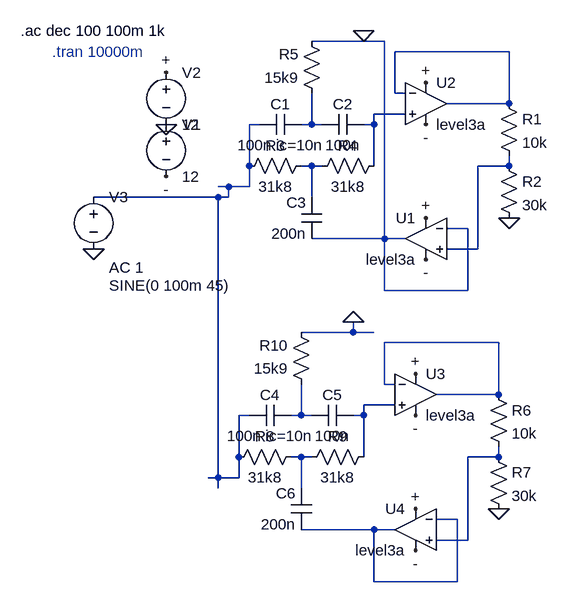
[diagram p0: schematic Filtro_NotchTwinT_DosTipos.asc]
Filtro_NotchTwinT_DosTipos.asc, the LTspice schematic file:
Version 4.1
SHEET 1 880 952
WIRE 80 112 -32 112
WIRE 272 128 96 128
WIRE 96 192 96 128
WIRE 112 192 96 192
WIRE 272 208 272 128
WIRE 272 208 176 208
WIRE 112 224 64 224
WIRE -112 240 -128 240
WIRE -32 240 -32 192
WIRE -32 240 -48 240
WIRE -16 240 -32 240
WIRE 64 240 64 224
WIRE 64 240 48 240
WIRE -128 304 -128 240
WIRE -32 304 -48 304
WIRE -16 304 -32 304
WIRE 64 304 64 240
WIRE 272 304 272 288
WIRE 272 304 224 304
WIRE -160 336 -176 336
WIRE -128 336 -128 304
WIRE -128 336 -160 336
WIRE -176 352 -368 352
WIRE -160 352 -160 336
WIRE -160 352 -176 352
WIRE -32 352 -32 304
WIRE 208 400 176 400
WIRE 80 416 80 112
WIRE 80 416 -32 416
WIRE 112 416 80 416
WIRE 224 432 224 304
WIRE 224 432 176 432
WIRE 80 496 80 416
WIRE 208 496 208 400
WIRE 208 496 80 496
WIRE 32 560 32 544
WIRE 32 560 -48 560
WIRE 64 560 32 560
WIRE 256 576 80 576
WIRE 80 640 80 576
WIRE 96 640 80 640
WIRE 256 656 256 576
WIRE 256 656 160 656
WIRE 96 672 48 672
WIRE -128 688 -144 688
WIRE -48 688 -48 640
WIRE -48 688 -64 688
WIRE -32 688 -48 688
WIRE 48 688 48 672
WIRE 48 688 32 688
WIRE -144 752 -144 688
WIRE -48 752 -64 752
WIRE -32 752 -48 752
WIRE 48 752 48 688
WIRE 256 752 256 736
WIRE 256 752 208 752
WIRE -176 784 -176 352
WIRE -176 784 -192 784
WIRE -144 784 -144 752
WIRE -144 784 -176 784
WIRE -176 800 -176 784
WIRE -48 800 -48 752
WIRE 192 848 160 848
WIRE 64 864 -48 864
WIRE 96 864 64 864
WIRE 208 880 208 752
WIRE 208 880 160 880
WIRE 64 944 64 864
WIRE 192 944 192 848
WIRE 192 944 64 944
FLAG -256 240 0
FLAG -256 160 +
FLAG 144 176 +
FLAG -256 320 -
FLAG 144 240 -
FLAG 144 384 +
FLAG 144 448 -
FLAG 272 384 0
FLAG 48 96 0
FLAG -368 432 0
FLAG 128 624 +
FLAG 128 688 -
FLAG 128 832 +
FLAG 128 896 -
FLAG 256 832 0
FLAG 32 544 0
SYMBOL OpAmps\\UniversalOpAmp3 144 208 R0
SYMATTR InstName U2
SYMBOL voltage -256 224 R0
WINDOW 123 0 0 Left 0
WINDOW 39 0 0 Left 0
SYMATTR InstName V1
SYMATTR Value 12
SYMBOL voltage -256 144 R0
WINDOW 123 0 0 Left 0
WINDOW 39 0 0 Left 0
SYMATTR InstName V2
SYMATTR Value 12
SYMBOL OpAmps\\UniversalOpAmp3 144 416 M0
SYMATTR InstName U1
SYMBOL res 256 192 R0
SYMATTR InstName R1
SYMATTR Value 10k
SYMBOL res 256 288 R0
SYMATTR InstName R2
SYMATTR Value 30k
SYMBOL cap -48 224 R90
WINDOW 0 0 32 VBottom 2
WINDOW 3 32 32 VTop 2
SYMATTR InstName C1
SYMATTR Value 100n ic=10n
SYMBOL cap 48 224 R90
WINDOW 0 0 32 VBottom 2
WINDOW 3 32 32 VTop 2
SYMATTR InstName C2
SYMATTR Value 100n
SYMBOL cap -16 416 R180
WINDOW 0 24 56 Left 2
WINDOW 3 24 8 Left 2
SYMATTR InstName C3
SYMATTR Value 200n
SYMBOL res -32 288 R90
WINDOW 0 0 56 VBottom 2
WINDOW 3 32 56 VTop 2
SYMATTR InstName R3
SYMATTR Value 31k8
SYMBOL res 80 288 R90
WINDOW 0 0 56 VBottom 2
WINDOW 3 32 56 VTop 2
SYMATTR InstName R4
SYMATTR Value 31k8
SYMBOL res -16 208 R180
WINDOW 0 36 76 Left 2
WINDOW 3 36 40 Left 2
SYMATTR InstName R5
SYMATTR Value 15k9
SYMBOL voltage -368 336 R0
WINDOW 3 24 152 Left 2
WINDOW 123 24 124 Left 2
WINDOW 39 0 0 Left 0
SYMATTR InstName V3
SYMATTR Value SINE(0 100m 45)
SYMATTR Value2 AC 1
SYMBOL OpAmps\\UniversalOpAmp3 128 656 R0
SYMATTR InstName U3
SYMBOL OpAmps\\UniversalOpAmp3 128 864 M0
SYMATTR InstName U4
SYMBOL res 240 640 R0
SYMATTR InstName R6
SYMATTR Value 10k
SYMBOL res 240 736 R0
SYMATTR InstName R7
SYMATTR Value 30k
SYMBOL cap -64 672 R90
WINDOW 0 0 32 VBottom 2
WINDOW 3 32 32 VTop 2
SYMATTR InstName C4
SYMATTR Value 100n ic=10n
SYMBOL cap 32 672 R90
WINDOW 0 0 32 VBottom 2
WINDOW 3 32 32 VTop 2
SYMATTR InstName C5
SYMATTR Value 100n
SYMBOL cap -32 864 R180
WINDOW 0 24 56 Left 2
WINDOW 3 24 8 Left 2
SYMATTR InstName C6
SYMATTR Value 200n
SYMBOL res -48 736 R90
WINDOW 0 0 56 VBottom 2
WINDOW 3 32 56 VTop 2
SYMATTR InstName R8
SYMATTR Value 31k8
SYMBOL res 64 736 R90
WINDOW 0 0 56 VBottom 2
WINDOW 3 32 56 VTop 2
SYMATTR InstName R9
SYMATTR Value 31k8
SYMBOL res -32 656 R180
WINDOW 0 36 76 Left 2
WINDOW 3 36 40 Left 2
SYMATTR InstName R10
SYMATTR Value 15k9
TEXT -480 96 Left 2 !.ac dec 100 100m 1k
TEXT -432 128 Left 2 ;.tran 10000m

The netlist it stands for:
* Filtro_NotchTwinT_DosTipos.asc
X§U2 N003 N002 + - N002 level3a  ; pins In+ In- V+ V- OUT
V1 0 - 12
V2 + 0 12
X§U1 N007 N001 + - N001 level3a  ; pins In+ In- V+ V- OUT
R1 N002 N007 10k
R2 N007 0 30k
C1 N005 N004 100n ic=10n
C2 N003 N005 100n
C3 N001 N006 200n
R3 N006 N004 31k8
R4 N003 N006 31k8
R5 N005 N001 15k9
V3 N004 0 SINE(0 100m 45) AC 1
X§U3 N009 N008 + - N008 level3a  ; pins In+ In- V+ V- OUT
X§U4 N012 N013 + - N013 level3a  ; pins In+ In- V+ V- OUT
R6 N008 N012 10k
R7 N012 0 30k
C4 N010 N004 100n ic=10n
C5 N009 N010 100n
C6 N013 N011 200n
R8 N011 N004 31k8
R9 N009 N011 31k8
R10 N010 0 15k9
.ac dec 100 100m 1k
* .tran 10000m
.backanno
.end